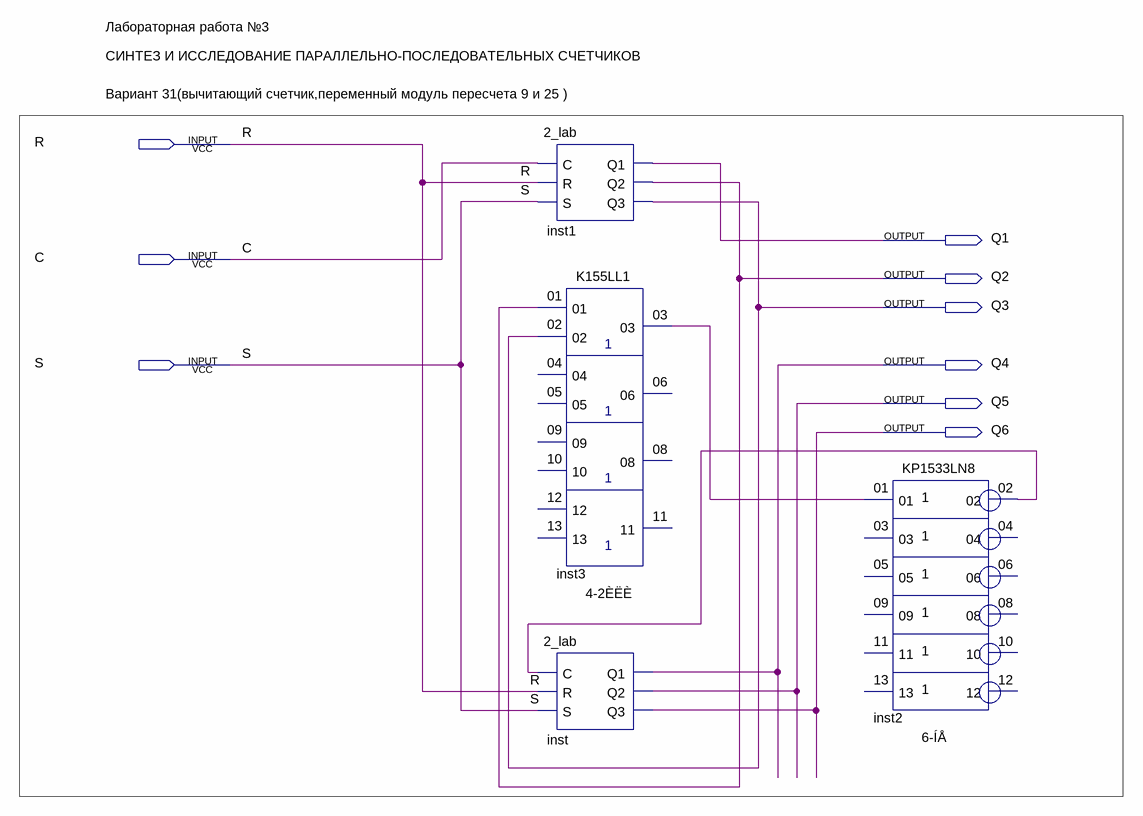
[diagram p0: schematic sheet]
// Quartus schematic 3_labb.bdf as structural Verilog: 4 symbols, 9 pins
module \3_labb  (
  input  R,
  input  C,
  input  S,
  output Q1,
  output Q2,
  output Q3,
  output Q4,
  output Q5,
  output Q6
);

  wire inst2_02, inst3_03;

  \2_lab  inst1 (.C(C), .R(R), .S(S), .Q1(Q1), .Q2(Q2), .Q3(Q3));
  K155LL1 inst3 (.\01 (Q2), .\02 (Q3), .\03 (inst3_03));  // open: 04, 05, 09, 10, 12, 13, 06, 08, 11
  \2_lab  inst (.C(inst2_02), .R(R), .S(S), .Q1(Q4), .Q2(Q5), .Q3(Q6));
  KP1533LN8 inst2 (.\01 (inst3_03), .\02 (inst2_02));  // open: 03, 05, 09, 11, 13, 04, 06, 08, 10, 12

  // Notes on the sheet:
  //   Лабораторная работа №3
  //   СИНТЕЗ И ИССЛЕДОВАНИЕ ПАРАЛЛЕЛЬНО-ПОСЛЕДОВАТЕЛЬНЫХ СЧЕТЧИКОВ
  //   Вариант 31(вычитающий счетчик,переменный модуль пересчета 9 и 25 )
endmodule
